# EAGLE design rfIMUv2 (EAGLE 7.6.0)
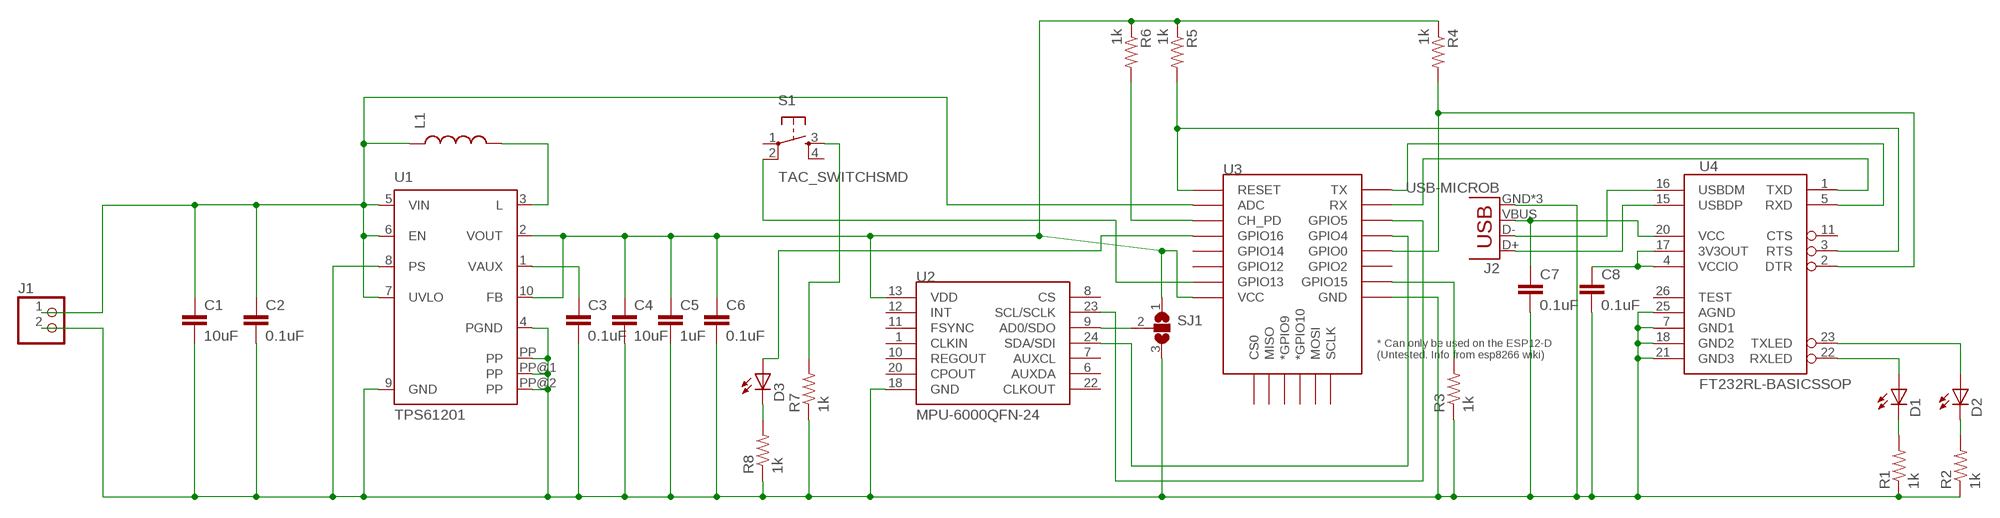
[diagram p0: schematic, sheet 1]

## Parts
C1  10uF  C-EUC0603  [C0603]
C2  0.1uF  C-EUC0603  [C0603]
C3  0.1uF  C-EUC0603  [C0603]
C4  10uF  C-EUC0603  [C0603]
C5  1uF  C-EUC0603  [C0603]
C6  0.1uF  C-EUC0603  [C0603]
C7  0.1uF  C-EUC0603  [C0603]
C8  0.1uF  C-EUC0603  [C0603]
D1  LEDCHIPLED_0603  [CHIPLED_0603]
D2  LEDCHIPLED_0603  [CHIPLED_0603]
D3  LEDCHIP-LED0603  [CHIP-LED0603]
J1  PINHD-1X2  [1X02]
J2  USB-MICROB  [USB-MICROB]
L1  INDUCTOR0805  [0805]
R1  1k  R-US_R0603  [R0603]
R2  1k  R-US_R0603  [R0603]
R3  1k  R-US_R0603  [R0603]
R4  1k  R-US_R0603  [R0603]
R5  1k  R-US_R0603  [R0603]
R6  1k  R-US_R0603  [R0603]
R7  1k  R-US_R0603  [R0603]
R8  1k  R-US_R0603  [R0603]
S1  TAC_SWITCHSMD  [TACTILE-SWITCH-SMD]
SJ1  SJ2W  [SJ_2]
U1  TPS61201  [S-PDSO-N10]
U2  MPU-6000QFN-24  [QFN-24-TESTING]
U3  ESP12ESMD  [ESP12E-SMD]
U4  FT232RL-BASICSSOP  [SSOP28DB]

## Nets
3V3: C4.1 C5.1 C6.1 R4.1 R5.1 R6.1 SJ1.1 U1.2(VOUT) U1.10(FB) U2.13(VDD) U3.VCC
D2: D2.C R2.2
DRX: U3.RXD0(RX) U4.1(TXD)
DTR: R4.2 U3.GPIO0 U4.2(DTR)
DTX: U3.TXD0(TX) U4.5(RXD)
GND: C1.2 C2.2 C3.2 C4.2 C5.2 C6.2 C7.2 C8.2 J1.2 J2.GND J2.MT1(GND) J2.MT2(GND) R1.1 R2.1 R3.1 R7.1 R8.1 SJ1.3 U1.4(PGND) U1.8(PS) U1.9(GND) U1.PP U1.PP@1(PP) U1.PP@2(PP) U2.18(GND) U3.GND U4.7(GND1) U4.18(GND2) U4.21(GND3) U4.25(AGND)
N$1: R3.2 U3.GPIO15
N$2: R6.2 U3.CH_PD
N$3: D2.A U4.23(TXLED)
N$4: D1.A U4.22(RXLED)
N$5: D1.C R1.2
N$6: C3.1 U1.1(VAUX)
N$7: SJ1.2 U2.9(AD0/SDO)
N$8: C8.1 U4.4(VCCIO) U4.17(3V3OUT)
N$9: L1.2 U1.3(L)
N$10: S1.2 U3.GPIO13
N$11: R7.2 S1.3
N$12: D3.A U3.GPIO16
N$13: D3.C R8.2
RESET: R5.2 U3.RESET U4.3(RTS)
SCL: U2.23(SCL/SCLK) U3.GPIO5
SDA: U2.24(SDA/SDI) U3.GPIO4
USBD+: J2.D+ U4.15(USBDP)
USBD-: J2.D- U4.16(USBDM)
VIN: C1.1 C2.1 J1.1 L1.1 U1.5(VIN) U1.6(EN) U1.7(UVLO) U3.ADC
VUSB: C7.1 J2.VBUS U4.20(VCC)
Unconnected: S1.1 S1.4 U2.1(CLKIN) U2.6(AUXDA) U2.7(AUXCL) U2.8(CS) U2.10(REGOUT) U2.11(FSYNC) U2.12(INT) U2.20(CPOUT) U2.22(CLKOUT) U3.CS0 U3.GPIO2 U3.GPIO9(*GPIO9) U3.GPIO10(*GPIO10) U3.GPIO12 U3.GPIO14 U3.MISO U3.MOSI U3.SCLK U4.11(CTS) U4.26(TEST)

## Library data of the parts
C1-C8 = resistor:C-EU: CAPACITOR, European symbol
D1-D3 = led:LED: LED OSRAM: - CHIPLED LG R971, LG N971, LY N971, LG Q971, LY Q971, LO R971, LY R971 LH N974, LH R974 LS Q976, LO Q976, LY Q976 LO Q996 - Hyper CHIPLED LW Q18S LB Q993, LB Q99A, LB R99A - SideLED LS A670, LO A670, LY A670, LG A670, LP A670 LB A673, LV A673, LT A673, LW A673 LH A674 LY A675 LS A676, LA A676, LO A676, LY A676, LW A676 LS A679, LY A679, LG A679 - Hyper Micro SIDELED® LS Y876, LA Y876, LO Y876, LY Y876 LT Y87S - SmartLED LW L88C, LW L88S LB L89C, LB L89S, LG L890 LS L89K, LO L89K, LY L89K LS L896, LA L896, LO L896, LY L896 - TOPLED LS T670, LO T670, LY T670, LG T670, LP T670 LSG T670, LSP T670, LSY T670, LOP T670, LYG T670 LG T671, LOG T671, LSG T671 LB T673, LV T673, LT T673, LW T673 LH T674 LS T676, LA T676, LO T676, LY T676, LB T676, LH T676, LSB T676, LW T676 LB T67C, LV T67C, LT T67C, LS T67K, LO T67K, LY T67K, LW E67C LS E67B, LA E67B, LO E67B, LY E67B, LB E67C, LV E67C, LT E67C LW T67C LS T679, LY T679, LG T679 LS T770, LO T770, LY T770, LG T770, LP T770 LB T773, LV T773, LT T773, LW T773 LH T774 LS E675, LA E675, LY E675, LS T675 LS T776, LA T776, LO T776, LY T776, LB T776 LHGB T686 LT T68C, LB T68C - Hyper Mini TOPLED® LB M676 - Mini TOPLED Santana® LG M470 LS M47K, LO M47K, LY M47K Source: http://www.osram.convergy.de LUXEON: - LUMILED® LXK2-PW12-R00, LXK2-PW12-S00, LXK2-PW14-U00, LXK2-PW14-V00 LXK2-PM12-R00, LXK2-PM12-S00, LXK2-PM14-U00 LXK2-PE12-Q00, LXK2-PE12-R00, LXK2-PE12-S00, LXK2-PE14-T00, LXK2-PE14-U00 LXK2-PB12-K00, LXK2-PB12-L00, LXK2-PB12-M00, LXK2-PB14-N00, LXK2-PB14-P00, LXK2-PB14-Q00 LXK2-PR12-L00, LXK2-PR12-M00, LXK2-PR14-Q00, LXK2-PR14-R00 LXK2-PD12-Q00, LXK2-PD12-R00, LXK2-PD12-S00 LXK2-PH12-R00, LXK2-PH12-S00 LXK2-PL12-P00, LXK2-PL12-Q00, LXK2-PL12-R00 Source: www.luxeon.com KINGBRIGHT: KA-3528ASYC Source: www.kingbright.com
J1 = pinhead:PINHD-1X2: PIN HEADER
J2 = SparkFun-Connectors:USB: USB Connectors USB-B-PTH is fully proven SKU : PRT-00139/CONN-08278 USB-miniB is fully proven SKU : PRT-00587 USB-A-PCB is untested. USB-A-H is throughly reviewed, but untested. Spark Fun Electronics SKU : PRT-00437 USB-B-SMT is throughly reviewed, but untested. Needs silkscreen touching up. USB-A-S has not been used/tested USB-MB-H has not been used/tested USB-MICROB has been used. CONN-09505; PROD_ID: CONN-09505
L1 = SparkFun-Passives:INDUCTOR: Inductors Basic Inductor/Choke - 0603 and 1206. Footprints are not proven and vary greatly between part numbers. INDUCTOR POWER 3.3UH 4.0A SMD 0.197" L x 0.197" W x 0.177" H (5.00mm x 5.00mm x 4.50mm)
R1-R8 = resistor:R-US_: RESISTOR, American symbol
S1 = SparkFun-Retired:TAC_SWITCH: Momentary Switch Button commonly used for reset or general input. Spark Fun Electronics SKU : COM-00097 SMT- SWCH-08247; PROD_ID: SWCH-08247
SJ1 = jumper:SJ2W: SMD solder JUMPER
U1 = texas:TPS6120*: LOW INPUT VOLTAGE SYNCHRONOUS BOOST CONVERTER WITH 1.3-A SWITCHES Source: http://focus.ti.com/lit/ds/symlink/tps61200.pdf; MPN: TPS61201DRCT; OC_FARNELL: unknown; OC_NEWARK: 37M0068
U2 = SparkFun-Sensors:MPU-6000: MPU-6000 - I2C address is 0x68 with AD0 low and 0x69 with AD0 high.
U3 = esp8266modules:ESP12E: ESP12E Module
U4 = SparkFun-DigitalIC:FT232RL-BASIC: USB UART This is the simplified version of the FT232RL unit. Only what you need, nothing you don't. Spark Fun Electronics SKU : COM-00650; PROD_ID: IC-00870

## Board
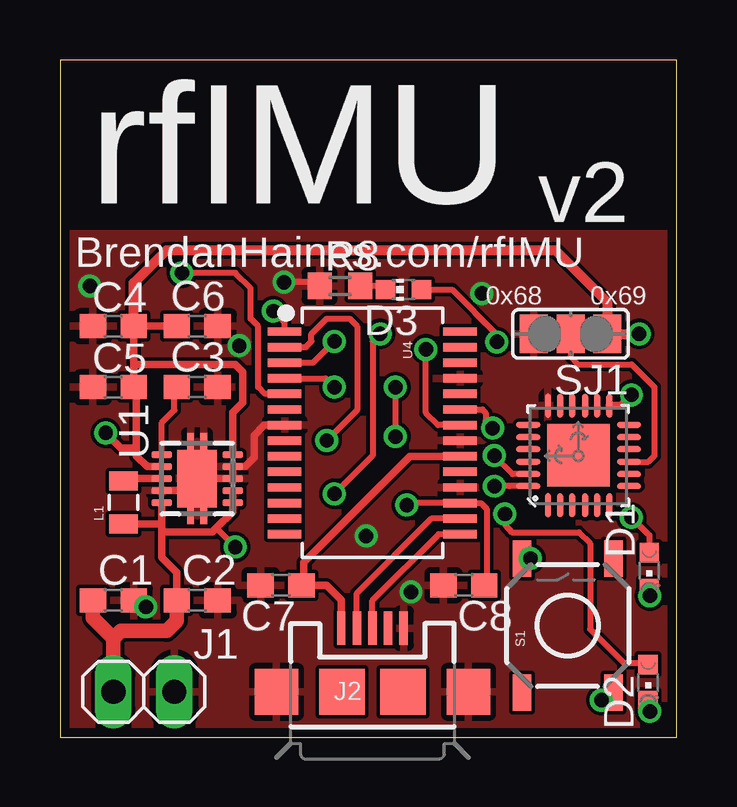
[diagram p1: board, top side]
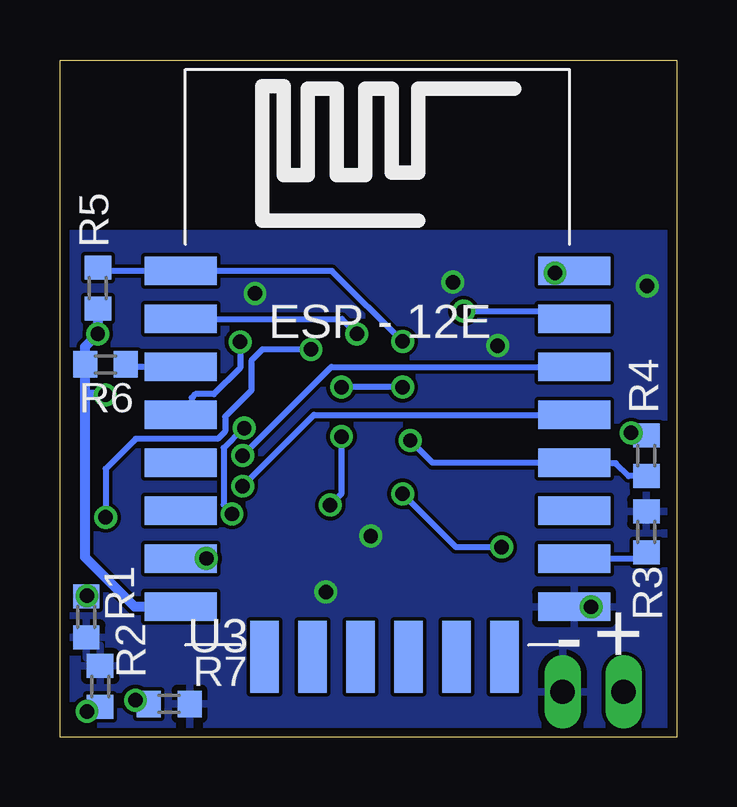
[diagram p2: board, bottom side, seen from below]

Size 25.7 x 28.25 mm. Coordinates in mm from the lower left corner, seen from the top.
Outline: 0,0 25.7,0 25.7,28.25 0,28.25 0,0
Copper layers (1*16): Top 0.0356mm / dielectric 1.5011mm / Bottom 0.0356mm
Design rules "oshpark-2layer": minimum track width 6mil, minimum drill 13mil, track to track 6mil, track to pad 6mil, pad to pad 6mil, via to via 6mil, smd to smd 6mil, copper to edge 15mil, drill to drill 6mil, minimum pad ring 7mil, minimum via ring 7mil, stop-mask expansion 2.5mil, vias tented up to drill 0mil, thermal gap 10mil

### Footprints (pad centres in the part's own frame; a part is rotated, then mirrored left to right if it is on the bottom)
C0603 = smd 1.1 x 1: 1 -0.85,0; 2 0.85,0
CHIPLED_0603 = smd 0.8 x 0.8: A 0,-0.75; C 0,0.75
CHIP-LED0603 = smd 0.8 x 0.8: A 0,-0.75; C 0,0.75
1X02 = drill 1.016 long: 1 -1.27,0; 2 1.27,0
USB-MICROB = smd 0.35 x 1.4: D+ 0,2.65; D- -0.65,2.65; GND 1.3,2.65; ID 0.65,2.65; VBUS -1.3,2.65 | smd 1.8 x 1.9: MT1 -4,0; MT2 4,0 | smd 1.9 x 1.9: P$1 -1.27,0; P$2 1.27,0
0805 = smd 0.8 x 1.2: 1 -0.9,0; 2 0.9,0
R0603 = smd 1 x 1.1: 1 -0.85,0; 2 0.85,0
TACTILE-SWITCH-SMD = smd 1.524 x 0.762: 1 -2.794,1.905; 2 2.794,1.905; 3 -2.794,-1.905; 4 2.794,-1.905
SJ_2 = smd 1.168 x 1.6: 1 -1.524,0; 2 0,0; 3 1.524,0
S-PDSO-N10 = smd 0.28 x 0.85: 1 -1,-1.475; 2 -0.5,-1.475; 3 0,-1.475; 4 0.5,-1.475; 5 1,-1.475; 6 1,1.475; 7 0.5,1.475; 8 0,1.475; 9 -0.5,1.475; 10 -1,1.475 | smd 2.4 x 1.65: PP 0,0 | smd 3.8 x 0.28: PP@1 0,0.275; PP@2 0,-0.275
QFN-24-TESTING = smd 1.016 x 0.254: 1 -2.066,1.257; 2 -2.066,0.75; 3 -2.066,0.247; 4 -2.066,-0.287; 5 -2.066,-0.792; 6 -2.066,-1.297; 13 2.086,-1.297; 14 2.086,-0.792; 15 2.086,-0.287; 16 2.086,0.247; 17 2.086,0.75; 18 2.086,1.257 | smd 0.254 x 1.016: 7 -1.267,-2.122; 8 -0.762,-2.122; 9 -0.258,-2.122; 10 0.278,-2.122; 11 0.78,-2.122; 12 1.287,-2.122; 19 1.287,2.082; 20 0.78,2.082; 21 0.278,2.082; 22 -0.258,2.082; 23 -0.762,2.082; 24 -1.267,2.082 | smd 2.616 x 2.616: P$1 0.02,-0.01
ESP12E-SMD = smd 3 x 1.2: ADC -8.3,3.8; CH_PD -8.3,1.8; GND 8.1,-8.2; GPIO0 8.1,-2.2; GPIO2 8.1,-4.2; GPIO4 8.1,-0.2; GPIO5 8.1,1.8; GPIO12 -8.3,-4.2; GPIO13 -8.3,-6.2; GPIO14 -8.3,-2.2; GPIO15 8.1,-6.2; GPIO16 -8.3,-0.2; RESET -8.3,5.8; RXD0 8.1,3.8; TXD0 8.1,5.8; VCC -8.3,-8.2 | smd 1.2 x 3: CS0 -4.8,-10.3; GPIO9 -0.8,-10.3; GPIO10 1.2,-10.3; MISO -2.8,-10.3; MOSI 3.2,-10.3; SCLK 5.2,-10.3
SSOP28DB = smd 0.348 x 1.397: 1 -4.225,-3.656; 2 -3.575,-3.656; 3 -2.925,-3.656; 4 -2.275,-3.656; 5 -1.625,-3.656; 6 -0.975,-3.656; 7 -0.325,-3.656; 8 0.325,-3.656; 9 0.975,-3.656; 10 1.625,-3.656; 11 2.275,-3.656; 12 2.925,-3.656; 13 3.575,-3.656; 14 4.225,-3.656; 15 4.225,3.656; 16 3.575,3.656; 17 2.925,3.656; 18 2.275,3.656; 19 1.625,3.656; 20 0.975,3.656; 21 0.325,3.656; 22 -0.325,3.656; 23 -0.975,3.656; 24 -1.625,3.656; 25 -2.275,3.656; 26 -2.925,3.656; 27 -3.575,3.656; 28 -4.225,3.656

### Placement (x,y rotation side)
C1  2.22,5.71 0 top
C2  5.71,5.71 0 top
C3  5.71,14.61 0 top
C4  2.22,17.14 180 top
C5  2.22,14.61 180 top
C6  5.71,17.14 0 top
C7  9.21,6.35 180 top
C8  16.83,6.35 180 top
D1  24.55,6.96 180 top
D2  24.5,2.29 180 top
D3  14.31,18.67 90 top
J1  3.49,1.91 0 top
J2  13.02,1.91 0 top
L1  2.64,9.8 90 top
R1  24.61,5.03 90 bottom
R2  24.03,2.13 270 bottom
R3  1.27,8.57 270 bottom
R4  1.27,11.75 270 bottom
R5  24.13,18.73 90 bottom
R6  23.81,15.56 0 bottom
R7  21.16,1.4 180 bottom
R8  11.67,18.82 0 top
S1  21.16,4.67 90 top
SJ1  21.27,16.83 180 top
U1  5.71,10.79 270 top
U2  21.59,11.75 90 top
U3  12.38,13.65 0 bottom
U4  13.02,12.7 270 top

### Tracks (layer width: path | path; a pad name or v marks a point on that pad's centre or on a via)
3V3  (via drill 0.6 pad 0.25)
  Top 0.305: U1.2 3.63,11.29 3.17,11.75 3.17,12.06 | 3.17,12.06 3.17,14.5 C5.1 3.07,15.56 | 3.07,15.56 C4.1 C6.1 | U2.13 23.36,13.83 v23.81,14.29 | v1.91,12.7 2.54,12.06 3.17,12.06 | U1.10 7.19,13.54 7.62,13.97 7.62,15.24 7.3,15.56 3.07,15.56
  Top 0.406: C4.1 3.07,18.95 4.45,20.32 20.64,20.32 22.8,18.16 SJ1.1 v24.13,16.83
  Bottom 0.254: R4.1 1.37,12.7 v1.91,12.7
  Bottom 0.406: R5.1 v24.13,16.83 24.66,16.3 R6.1 24.66,14.29 | U3.VCC 22.6,5.45 24.66,7.52 24.66,14.29 | v23.81,14.29 24.66,14.29
D2  (via drill 0.6 pad 0.25)
  Top 0.254: D2.C 24.5,1.17 v24.58,1.09
  Bottom 0.254: v24.58,1.09 24.22,1.09 R2.2
DRX  (via drill 0.6 pad 0.25)
  Top 0.254: U4.1 9.36,17.31 v8.89,17.78
  Bottom 0.254: v8.89,17.78 4.61,17.78 U3.RXD0
DTR  (via drill 0.6 pad 0.25)
  Top 0.254: v11.11,12.38 12.38,13.65 12.38,17.14 12.06,17.46 11.11,17.46 10.48,16.83 10.48,16.51 10.24,16.27 U4.2
  Bottom 0.254: R4.2 2.01,10.9 2.54,11.43 4.26,11.43 U3.GPIO0 10.18,11.45 v11.11,12.38
DTX  (via drill 0.6 pad 0.25)
  Top 0.254: U4.5 8.54,14.32 8.26,14.61 8.26,17.14 7.94,17.46 7.94,18.73 7.3,19.37 v5.08,19.37
  Bottom 0.254: v5.08,19.37 4.37,19.37 U3.TXD0
GND  (via drill 0.6 pad 0.25)
  Top 0.254: R8.1 10.66,18.98 v9.34,18.98
  Top 0.305: U1.4 4.94,10.29 U1.PP@2 | U1.PP@1 U1.8 U1.9 7.72,11.29 8.09,11.67 8.09,12.6 8.51,13.03 U4.7
  other vias: 14.62,6.07 12.76,8.4 1.24,18.82 7.47,16.34 3.58,5.45 17.58,18.51
  pour Top: -1.87,-1.71 27.23,-1.71 27.07,21 -1.87,21
  pour Bottom: -1.87,21 27.23,21 27.23,-1.87 -6.69,-2.49 -6.69,20.22
N$1
  Bottom 0.254: R3.2 1.54,7.45 U3.GPIO15
N$2
  Bottom 0.254: U3.CH_PD 22.86,15.45 R6.2
N$3  (via drill 0.6 pad 0.25)
  Top 0.254: v18.54,9.32 18.55,8.87 18.82,8.56 21.62,8.56 22.09,8.09 22.09,4.51 23.49,3.11 24.43,3.11 D2.A | U4.23 17.6,13.68 17.74,13.54 17.74,13.19 v18.03,12.9
  Bottom 0.254: v18.54,9.32 18.89,9.71 18.89,12.07 18.06,12.9 v18.03,12.9
N$4  (via drill 0.6 pad 0.25)
  Top 0.254: U4.22 15.76,13.03 15.25,13.54 v15.25,16.18 | v23.8,9.18 24.55,8.43 D1.A
  Bottom 0.254: v15.25,16.18 17.27,16.18 17.74,15.71 17.74,14.47 18.82,13.38 18.82,12.76 19.14,12.45 22.56,12.45 23.8,11.2 v23.8,9.18
N$5  (via drill 0.6 pad 0.25)
  Top 0.254: D1.C 24.57,6.05 v24.58,5.91
  Bottom 0.254: v24.58,5.91 24.49,5.76 R1.2
N$6
  Top 0.254: U1.1 4.24,13.13 4.76,13.65 4.76,14.5 C3.1
N$7
  Top 0.254: SJ1.2 21.27,15.88 21.59,15.56 23.81,15.56 24.77,14.61 24.77,11.75 24.51,11.49 U2.9
N$8  (via drill 0.6 pad 0.25)
  Top 0.254: C8.1 17.78,6.45 17.78,9.53 17.53,9.78 U4.17 14.54,9.78 v14.45,9.69 | U4.4 11.06,14.97 v11.43,14.61 | v13.98,14.61 v13.98,12.54
  Bottom 0.254: v11.43,14.61 v13.98,14.61 | v13.98,12.54 13.98,10.16 v14.45,9.69
N$9
  Top 0.305: U1.3 2.89,10.79 L1.2
N$10  (via drill 0.6 pad 0.25)
  Top 0.254: S1.2 v19.6,7.46 v19.6,7.47
  Bottom 0.254: v19.6,7.47 20.67,7.47 U3.GPIO13
N$11  (via drill 0.6 pad 0.25)
  Top 0.254: S1.3 22.75,1.56 v22.56,1.56
  Bottom 0.254: v22.56,1.56 22.16,1.56 R7.2
N$12  (via drill 0.6 pad 0.25)
  Top 0.254: D3.A 16.34,18.67 18.2,16.8 v18.2,16.49
  Bottom 0.254: v18.2,16.49 18.2,15.4 19.29,14.31 20.07,14.31 20.23,14.16 20.23,13.91 U3.GPIO16
N$13
  Top 0.254: D3.C 13.41,18.82 R8.2
RESET  (via drill 0.6 pad 0.25)
  Top 0.254: U4.3 10.54,15.62 v11.43,16.51
  Bottom 0.254: v11.43,16.51 14.37,19.45 U3.RESET 24,19.45 R5.2
SCL  (via drill 0.6 pad 0.25)
  Top 0.254: U2.23 18.86,10.98 v18.1,11.75
  Bottom 0.254: v18.1,11.75 14.4,15.45 U3.GPIO5
SDA  (via drill 0.6 pad 0.25)
  Top 0.254: U2.24 18.74,10.48 v18.1,10.48
  Bottom 0.254: v18.1,10.48 15.12,13.45 U3.GPIO4
USBD+
  Top 0.254: J2.D+ 13.02,5.71 15.78,8.47 U4.15
USBD-
  Top 0.254: J2.D- 12.37,6.02 15.47,9.12 U4.16
VIN  (via drill 0.6 pad 0.25)
  Top 0.254: v11.43,10.16 13.02,11.75 13.02,16.52 v13.34,16.83 | v7.3,7.94 6.51,8.73
  Top 0.305: U1.5 4.24,8.87 | 4.24,8.87 4.24,8.57 | 4.24,8.57 4.24,7.51 4.87,6.88 C2.1 | U1.7 U1.6 7.19,9.41 6.51,8.73 6.35,8.57 4.24,8.57 | L1.1 4.21,8.9 4.24,8.87
  Top 0.61: C1.1 1.37,4.98 2.22,4.13 | 2.22,4.13 J1.1 | C2.1 4.87,4.87 4.45,4.45 2.54,4.45 2.22,4.13
  Bottom 0.254: U3.ADC 13.96,17.45 v13.34,16.83 | v11.43,10.16 9.21,7.94 v7.3,7.94
VUSB
  Top 0.305: J2.VBUS 11.72,5.75 11.11,6.35 C7.1 10.16,6.45 10.16,7.3 14.58,11.72 U4.20

### Text on the board
tSilk: + | -
_tsilk: rfIMU | v2 | BrendanHaines.com/rfIMU | 0x68 | 0x69
_bsilk: + | -